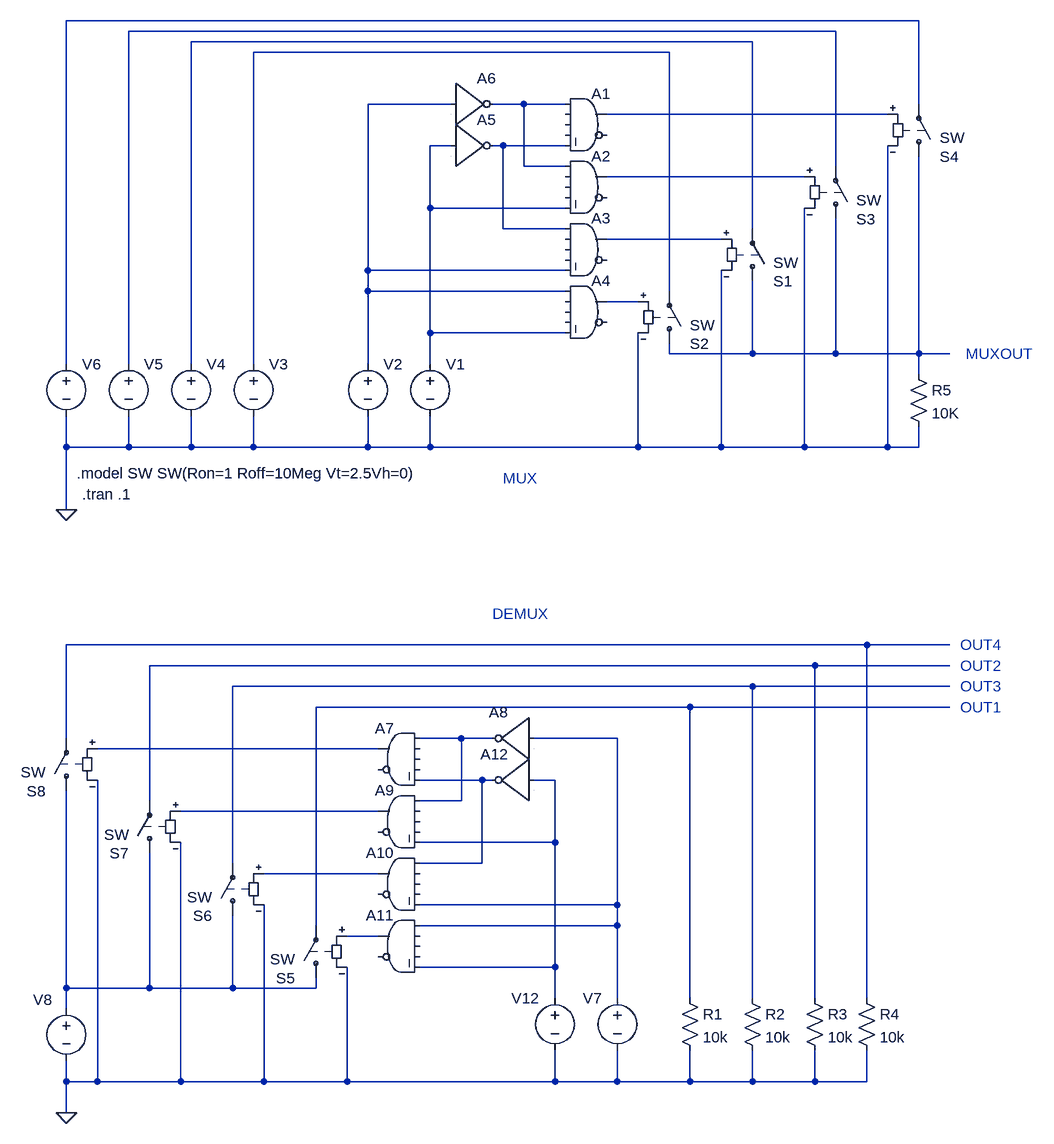
[diagram p0: schematic Mux-demux.asc]
Mux-demux.asc, the LTspice schematic file:
Version 4
SHEET 1 880 1716
WIRE 512 -48 -800 -48
WIRE 384 -32 -704 -32
WIRE 256 -16 -608 -16
WIRE 128 0 -512 0
WIRE -208 80 -336 80
WIRE -96 80 -144 80
WIRE -32 80 -96 80
WIRE 512 80 512 -48
WIRE 464 96 32 96
WIRE -208 144 -240 144
WIRE -128 144 -144 144
WIRE -32 144 -128 144
WIRE -96 176 -96 80
WIRE -32 176 -96 176
WIRE 384 176 384 -32
WIRE 336 192 32 192
WIRE -240 240 -240 144
WIRE -32 240 -240 240
WIRE -128 272 -128 144
WIRE -32 272 -128 272
WIRE 256 272 256 -16
WIRE 208 288 32 288
WIRE -336 336 -336 80
WIRE -32 336 -336 336
WIRE -336 368 -336 336
WIRE -32 368 -336 368
WIRE 128 368 128 0
WIRE 80 384 32 384
WIRE -240 432 -240 240
WIRE -32 432 -240 432
WIRE 128 464 128 448
WIRE 256 464 256 352
WIRE 256 464 128 464
WIRE 384 464 384 256
WIRE 384 464 256 464
WIRE 512 464 512 160
WIRE 512 464 384 464
WIRE 560 464 512 464
WIRE -800 480 -800 -48
WIRE -704 480 -704 -32
WIRE -608 480 -608 -16
WIRE -512 480 -512 0
WIRE -336 480 -336 368
WIRE -240 480 -240 432
WIRE 512 496 512 464
WIRE -800 608 -800 560
WIRE -704 608 -704 560
WIRE -704 608 -800 608
WIRE -608 608 -608 560
WIRE -608 608 -704 608
WIRE -512 608 -512 560
WIRE -512 608 -608 608
WIRE -336 608 -336 560
WIRE -336 608 -512 608
WIRE -240 608 -240 560
WIRE -240 608 -336 608
WIRE 80 608 80 432
WIRE 80 608 -240 608
WIRE 208 608 208 336
WIRE 208 608 80 608
WIRE 336 608 336 240
WIRE 336 608 208 608
WIRE 464 608 464 144
WIRE 464 608 336 608
WIRE 512 608 512 576
WIRE 512 608 464 608
WIRE -800 704 -800 608
WIRE 432 912 -800 912
WIRE 560 912 432 912
WIRE 352 944 -672 944
WIRE 560 944 352 944
WIRE 256 976 -544 976
WIRE 560 976 256 976
WIRE 160 1008 -416 1008
WIRE 560 1008 160 1008
WIRE -800 1056 -800 912
WIRE -192 1056 -256 1056
WIRE -144 1056 -192 1056
WIRE 48 1056 -80 1056
WIRE -320 1072 -752 1072
WIRE -160 1120 -256 1120
WIRE -144 1120 -160 1120
WIRE -48 1120 -80 1120
WIRE -672 1152 -672 944
WIRE -192 1152 -192 1056
WIRE -192 1152 -256 1152
WIRE -320 1168 -624 1168
WIRE -48 1216 -48 1120
WIRE -48 1216 -256 1216
WIRE -544 1248 -544 976
WIRE -160 1248 -160 1120
WIRE -160 1248 -256 1248
WIRE -320 1264 -496 1264
WIRE 48 1312 48 1056
WIRE 48 1312 -256 1312
WIRE -416 1344 -416 1008
WIRE 48 1344 48 1312
WIRE 48 1344 -256 1344
WIRE -320 1360 -368 1360
WIRE -48 1408 -48 1216
WIRE -48 1408 -256 1408
WIRE -800 1440 -800 1136
WIRE -672 1440 -672 1232
WIRE -672 1440 -800 1440
WIRE -544 1440 -544 1328
WIRE -544 1440 -672 1440
WIRE -416 1440 -416 1424
WIRE -416 1440 -544 1440
WIRE -48 1456 -48 1408
WIRE 48 1456 48 1344
WIRE 160 1456 160 1008
WIRE 256 1456 256 976
WIRE 352 1456 352 944
WIRE 432 1456 432 912
WIRE -800 1472 -800 1440
WIRE -800 1584 -800 1552
WIRE -752 1584 -752 1120
WIRE -752 1584 -800 1584
WIRE -624 1584 -624 1216
WIRE -624 1584 -752 1584
WIRE -496 1584 -496 1312
WIRE -496 1584 -624 1584
WIRE -368 1584 -368 1408
WIRE -368 1584 -496 1584
WIRE -48 1584 -48 1536
WIRE -48 1584 -368 1584
WIRE 48 1584 48 1536
WIRE 48 1584 -48 1584
WIRE 160 1584 160 1536
WIRE 160 1584 48 1584
WIRE 256 1584 256 1536
WIRE 256 1584 160 1584
WIRE 352 1584 352 1536
WIRE 352 1584 256 1584
WIRE 432 1584 432 1536
WIRE 432 1584 352 1584
WIRE -800 1632 -800 1584
FLAG -800 704 0
FLAG -800 1632 0
SYMBOL Digital\\and 0 48 R0
WINDOW 3 16 52 Invisible 0
SYMATTR Value vhigh 5V trise 1e-6 tfall 1e-6
SYMATTR InstName A1
SYMBOL Digital\\inv -208 16 R0
WINDOW 3 8 60 Invisible 0
SYMATTR Value vhigh 5V trise 1e-6 tfall 1e-6
SYMATTR InstName A6
SYMBOL sw 128 464 M180
WINDOW 0 32 15 Left 0
WINDOW 3 32 44 Left 0
SYMATTR InstName S2
SYMBOL sw 256 368 M180
WINDOW 0 32 15 Left 0
WINDOW 3 32 44 Left 0
SYMATTR InstName S1
SYMBOL sw 384 272 M180
WINDOW 0 32 15 Left 0
WINDOW 3 32 44 Left 0
SYMATTR InstName S3
SYMBOL sw 512 176 M180
WINDOW 0 32 15 Left 0
WINDOW 3 32 44 Left 0
SYMATTR InstName S4
SYMBOL voltage -336 464 R0
WINDOW 3 24 104 Invisible 0
WINDOW 123 0 0 Left 0
WINDOW 39 0 0 Left 0
SYMATTR Value PULSE(0 5 0 1e-7 1e-7 1e-2 2e-2)
SYMATTR InstName V2
SYMBOL voltage -512 464 R0
WINDOW 3 24 104 Invisible 0
WINDOW 123 0 0 Left 0
WINDOW 39 0 0 Left 0
SYMATTR Value SINE(0 1 4000)
SYMATTR InstName V3
SYMBOL voltage -608 464 R0
WINDOW 3 24 104 Invisible 0
WINDOW 123 0 0 Left 0
WINDOW 39 0 0 Left 0
SYMATTR Value SINE(0 1 3000)
SYMATTR InstName V4
SYMBOL voltage -704 464 R0
WINDOW 3 24 104 Invisible 0
WINDOW 123 0 0 Left 0
WINDOW 39 0 0 Left 0
SYMATTR Value SINE(0 1 2000)
SYMATTR InstName V5
SYMBOL voltage -800 464 R0
WINDOW 3 24 104 Invisible 0
WINDOW 123 0 0 Left 0
WINDOW 39 0 0 Left 0
SYMATTR Value SINE(0 1 1000)
SYMATTR InstName V6
SYMBOL Digital\\and 0 144 R0
WINDOW 3 16 52 Invisible 0
SYMATTR Value vhigh 5V trise 1e-6 tfall 1e-6
SYMATTR InstName A2
SYMBOL Digital\\and 0 240 R0
WINDOW 3 16 52 Invisible 0
SYMATTR Value vhigh 5V trise 1e-6 tfall 1e-6
SYMATTR InstName A3
SYMBOL Digital\\and 0 336 R0
WINDOW 3 16 52 Invisible 0
SYMATTR Value vhigh 5V trise 1e-6 tfall 1e-6
SYMATTR InstName A4
SYMBOL Digital\\inv -208 80 R0
WINDOW 3 8 60 Invisible 0
SYMATTR Value vhigh 5V trise 1e-6 tfall 1e-6
SYMATTR InstName A5
SYMBOL voltage -240 464 R0
WINDOW 3 24 104 Invisible 0
WINDOW 123 0 0 Left 0
WINDOW 39 0 0 Left 0
SYMATTR Value PULSE(0 5 0 1e-7 1e-7 2e-2 4e-2)
SYMATTR InstName V1
SYMBOL Digital\\and -288 1024 M0
WINDOW 3 16 52 Invisible 0
SYMATTR Value vhigh 5V trise 1e-6 tfall 1e-6
SYMATTR InstName A7
SYMBOL Digital\\inv -80 992 M0
WINDOW 3 8 60 Invisible 0
SYMATTR Value vhigh 5V trise 1e-6 tfall 1e-6
SYMATTR InstName A8
SYMBOL sw -416 1440 R180
WINDOW 0 32 15 Left 0
WINDOW 3 32 44 Left 0
SYMATTR InstName S5
SYMBOL sw -544 1344 R180
WINDOW 0 32 15 Left 0
WINDOW 3 32 44 Left 0
SYMATTR InstName S6
SYMBOL sw -672 1248 R180
WINDOW 0 32 15 Left 0
WINDOW 3 32 44 Left 0
SYMATTR InstName S7
SYMBOL sw -800 1152 R180
WINDOW 0 32 15 Left 0
WINDOW 3 32 44 Left 0
SYMATTR InstName S8
SYMBOL voltage 48 1440 M0
WINDOW 3 24 104 Invisible 0
WINDOW 123 0 0 Left 0
WINDOW 39 0 0 Left 0
SYMATTR Value PULSE(0 5 0 1e-7 1e-7 1e-2 2e-2)
SYMATTR InstName V7
SYMBOL Digital\\and -288 1120 M0
WINDOW 3 16 52 Invisible 0
SYMATTR Value vhigh 5V trise 1e-6 tfall 1e-6
SYMATTR InstName A9
SYMBOL Digital\\and -288 1216 M0
WINDOW 3 16 52 Invisible 0
SYMATTR Value vhigh 5V trise 1e-6 tfall 1e-6
SYMATTR InstName A10
SYMBOL Digital\\and -288 1312 M0
WINDOW 3 16 52 Invisible 0
SYMATTR Value vhigh 5V trise 1e-6 tfall 1e-6
SYMATTR InstName A11
SYMBOL Digital\\inv -80 1056 M0
WINDOW 3 8 60 Invisible 0
SYMATTR Value vhigh 5V trise 1e-6 tfall 1e-6
SYMATTR InstName A12
SYMBOL voltage -48 1440 M0
WINDOW 3 24 104 Invisible 0
WINDOW 123 0 0 Left 0
WINDOW 39 0 0 Left 0
SYMATTR Value PULSE(0 5 0 1e-7 1e-7 2e-2 4e-2)
SYMATTR InstName V12
SYMBOL voltage -800 1456 R0
WINDOW 3 24 104 Invisible 0
WINDOW 123 0 0 Left 0
WINDOW 39 0 0 Left 0
WINDOW 0 -51 2 Left 0
SYMATTR Value SINE(0 1 1000)
SYMATTR InstName V8
SYMBOL res 144 1440 R0
SYMATTR InstName R1
SYMATTR Value 10k
SYMBOL res 240 1440 R0
SYMATTR InstName R2
SYMATTR Value 10k
SYMBOL res 336 1440 R0
SYMATTR InstName R3
SYMATTR Value 10k
SYMBOL res 416 1440 R0
SYMATTR InstName R4
SYMATTR Value 10k
SYMBOL res 496 480 R0
SYMATTR InstName R5
SYMATTR Value 10K
TEXT -784 648 Left 0 !.model SW SW(Ron=1 Roff=10Meg Vt=2.5Vh=0)
TEXT -776 680 Left 0 !.tran .1
TEXT 584 464 Left 0 ;MUXOUT
TEXT 576 1008 Left 0 ;OUT1
TEXT 576 944 Left 0 ;OUT2
TEXT 576 976 Left 0 ;OUT3
TEXT 576 912 Left 0 ;OUT4
TEXT -128 656 Left 0 ;MUX
TEXT -144 864 Left 0 ;DEMUX

The netlist it stands for:
* Mux-demux.asc
A1 N006 0 0 0 N009 0 N007 0 AND vhigh 5V trise 1e-6 tfall 1e-6
A6 N005 0 0 0 0 N006 0 0 BUF vhigh 5V trise 1e-6 tfall 1e-6
S2 N013 N004 N012 0 SW
S1 N013 N003 N011 0 SW
S3 N013 N002 N010 0 SW
S4 N013 N001 N007 0 SW
V2 N005 0 PULSE(0 5 0 1e-7 1e-7 1e-2 2e-2)
V3 N004 0 SINE(0 1 4000)
V4 N003 0 SINE(0 1 3000)
V5 N002 0 SINE(0 1 2000)
V6 N001 0 SINE(0 1 1000)
A2 N006 0 0 0 N008 0 N010 0 AND vhigh 5V trise 1e-6 tfall 1e-6
A3 N009 0 0 0 N005 0 N011 0 AND vhigh 5V trise 1e-6 tfall 1e-6
A4 N005 0 0 0 N008 0 N012 0 AND vhigh 5V trise 1e-6 tfall 1e-6
A5 N008 0 0 0 0 N009 0 0 BUF vhigh 5V trise 1e-6 tfall 1e-6
V1 N008 0 PULSE(0 5 0 1e-7 1e-7 2e-2 4e-2)
A7 N018 0 0 0 N021 0 N020 0 AND vhigh 5V trise 1e-6 tfall 1e-6
A8 N019 0 0 0 0 N018 0 0 BUF vhigh 5V trise 1e-6 tfall 1e-6
S5 N026 N017 N025 0 SW
S6 N026 N016 N024 0 SW
S7 N026 N015 N023 0 SW
S8 N026 N014 N020 0 SW
V7 N019 0 PULSE(0 5 0 1e-7 1e-7 1e-2 2e-2)
A9 N018 0 0 0 N022 0 N023 0 AND vhigh 5V trise 1e-6 tfall 1e-6
A10 N021 0 0 0 N019 0 N024 0 AND vhigh 5V trise 1e-6 tfall 1e-6
A11 N019 0 0 0 N022 0 N025 0 AND vhigh 5V trise 1e-6 tfall 1e-6
A12 N022 0 0 0 0 N021 0 0 BUF vhigh 5V trise 1e-6 tfall 1e-6
V12 N022 0 PULSE(0 5 0 1e-7 1e-7 2e-2 4e-2)
V8 N026 0 SINE(0 1 1000)
R1 N017 0 10k
R2 N016 0 10k
R3 N015 0 10k
R4 N014 0 10k
R5 N013 0 10K
.model SW SW(Ron=1 Roff=10Meg Vt=2.5Vh=0)
.tran .1
* MUXOUT
* OUT1
* OUT2
* OUT3
* OUT4
* MUX
* DEMUX
.backanno
.end